# Altium project TermoDeep.PrjPcb
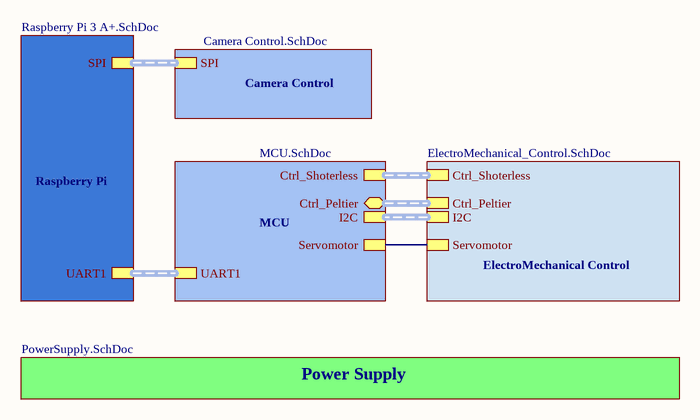
[diagram p0: TermoDeep.SchDoc]
6 sheets, 79 parts. Net scope: hierarchical (ports join the sheet entries above them; power ports are global).
Board file: TermoDeep.PcbDoc
Sheets:
  TermoDeep.SchDoc
    Power Supply = PowerSupply.SchDoc
    MCU = MCU.SchDoc
    ElectroMechanical Control = ElectroMechanical_Control.SchDoc
    Raspberry Pi = Raspberry Pi 3 A+.SchDoc
    Camera Control = Camera Control.SchDoc

## Sheet TermoDeep.SchDoc: Termodeep
size A4; Revision: V1.10 Rev A; Proyect DSD: Termodeep; Version: V 1.0  Rev A

### Sub-sheets
Camera Control = Camera Control.SchDoc: SPI (harness SPI)
ElectroMechanical Control = ElectroMechanical_Control.SchDoc: Ctrl_Peltier (harness Ctrl_Peltier), Ctrl_Shoterless (harness Ctrl_Shoterless), Servomotor, I2C (harness I2C)
MCU = MCU.SchDoc: Ctrl_Peltier (bidir, harness Ctrl_Peltier), Ctrl_Shoterless (harness Ctrl_Shoterless), Servomotor, UART1 (harness UART1), I2C
Power Supply = PowerSupply.SchDoc: no entries
Raspberry Pi = Raspberry Pi 3 A+.SchDoc: UART1 (harness UART1), SPI (harness SPI)

### Nets
D2: sheet MCU/Servomotor, sheet ElectroMechanical Control/Servomotor

### Buses and harness runs
harness sheet Camera Control/SPI = sheet Raspberry Pi/SPI
harness sheet ElectroMechanical Control/Ctrl_Peltier = sheet MCU/Ctrl_Peltier
harness sheet ElectroMechanical Control/Ctrl_Shoterless = sheet MCU/Ctrl_Shoterless
harness sheet ElectroMechanical Control/I2C = sheet MCU/I2C
harness sheet MCU/UART1 = sheet Raspberry Pi/UART1

### Notes on the sheet
- Title
- Size:
- Date:
- A4
- Version
- Sheet
- of
- DeepSea Developments
- Cll  2A # 24C - 25
- Cali, Valle del Cauca
- Colombia
- www.dsd.dev
- Proyect:

## Sheet PowerSupply.SchDoc: TermoDeep - Power Supply
size A4; Revision: V1.0 Rev A; Proyect DSD: TermoDeep; Version: V 1.0  Rev A
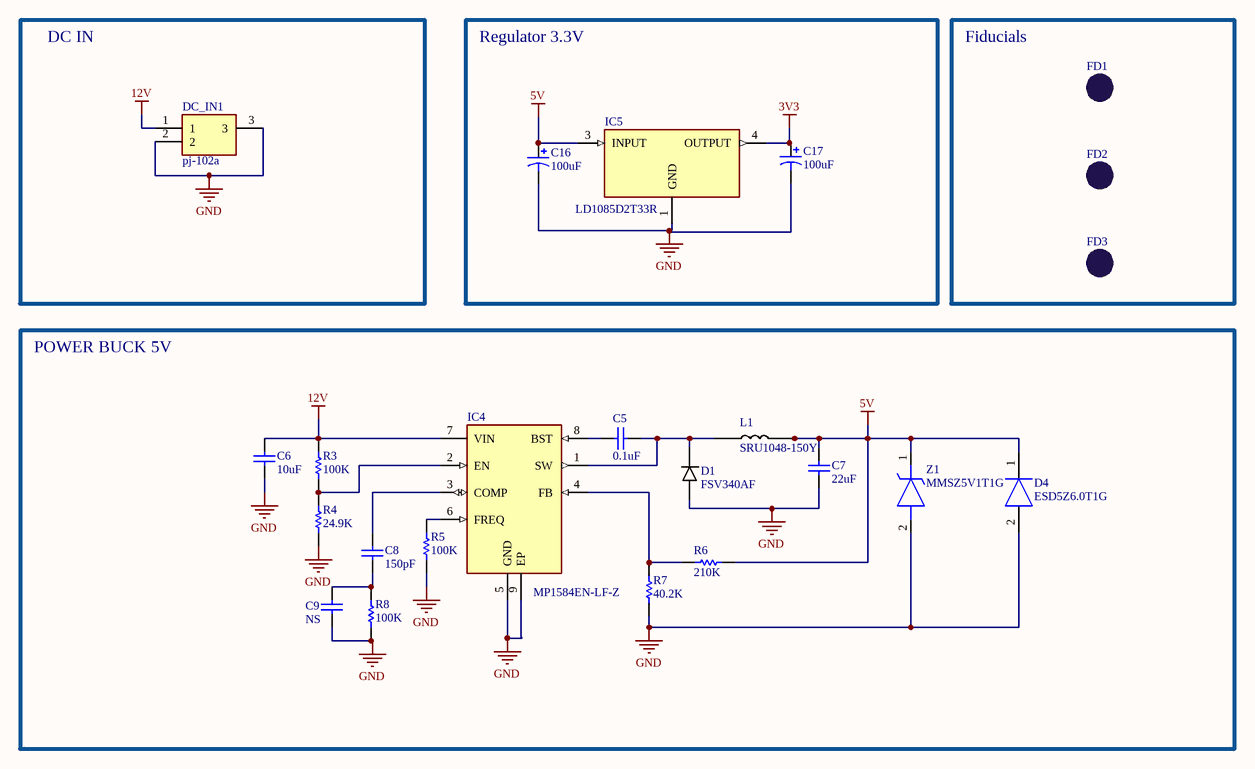
[diagram p1: PowerSupply.SchDoc]

### Parts
C5  0.1uF  [C0603_N]
C6  10uF  [C0805_N]
C7  22uF  [C0805_N]
C8  150pF  [C0603_N]
C9  NS  [C0603_N]
C16  100uF  [C_TANT_A_3216_N]
C17  100uF  [C_TANT_A_3216_N]
D1  FSV340AF  [SODFL4725X100N]
D4  ESD5Z6.0T1G  [SODFL1608X70N]
DC_IN1  pj-102a  [PJ059A]
FD1  Fiducial  [Fiducial]  (value not drawn)
FD2  Fiducial  [Fiducial]  (value not drawn)
FD3  Fiducial  [Fiducial]  (value not drawn)
IC4  MP1584EN-LF-Z  [SOIC127P600X170-9N]
IC5  LD1085D2T33R  [LD1085D2T33R]
L1  SRU1048-150Y  [SRU10486R8Y]
R3  100K  [R0603_N]
R4  24.9K  [R0603_N]
R5  100K  [R0603_N]
R6  210K  [R0603_N]
R7  40.2K  [R0603_N]
R8  100K  [R0603_N]
Z1  MMSZ5V1T1G  [SOD3716X135N]

### Blocks framed on the sheet
DC IN: DC_IN1
Regulator 3.3V: C16 C17 IC5
Fiducials: FD1-FD3
POWER BUCK 5V: C5-C9 D1 D4 IC4 L1 R3-R8 Z1

### Nets
3V3: C17.1 IC5.4(OUTPUT)
5V: C7.1 C16.1 D4.1(K) IC5.3(INPUT) L1.2 R6.1 Z1.1(K)
12V: C6.2 DC_IN1.1 IC4.7(VIN) R3.1
GND: C6.1 C7.2 C9.1 C16.2 C17.2 D1.2(A) D4.2(A) DC_IN1.2 DC_IN1.3 IC4.5(GND) IC4.9(EP) IC5.1(GND) R4.2 R5.2 R7.1 R8.2 Z1.2(A)
NetC5_1: C5.1 D1.1(K) IC4.1(SW) L1.1
NetC5_2: C5.2 IC4.8(BST)
NetC8_1: C8.1 C9.2 R8.1
NetC8_2: C8.2 IC4.3(COMP)
NetIC4_2: IC4.2(EN) R3.2 R4.1
NetIC4_4: IC4.4(FB) R6.2 R7.2
NetIC4_6: IC4.6(FREQ) R5.1

### Notes on the sheet
- Title
- Size:
- Date:
- A4
- Version
- Sheet
- of
- DeepSea Developments
- Cll  2A # 24C - 25
- Cali, Valle del Cauca
- Colombia
- www.dsd.dev
- Proyect:

### Library data of the parts
C5-C9 = C_SMD
  C5: Value: 0.1uF
  C6: Value: 10uF
  C7: Value: 22uF
  C8: Value: 150pF
  C9: Value: NS
C16 C17 = CP_SMD: Value: 100uF
D1 = FSV340AF: Diode; Manufacturer_Name: ON Semiconductor; Datasheet Link: https://componentsearchengine.com/Datasheets/1/FSV340AF.pdf; Height: 1mm; Manufacturer_Part_Number: FSV340AF; Mouser Part Number: 512-FSV340AF; Mouser Price/Stock: https://www.mouser.com/Search/Refine.aspx?Keyword=512-FSV340AF
D4 = ESD5Z6.0T1G: Diode; Manufacturer_Name: ON Semiconductor; Datasheet Link: http://www.onsemi.com/pub/Collateral/ESD5Z2.5T1-D.PDF; Height: 0.7mm; Manufacturer_Part_Number: ESD5Z6.0T1G; Arrow Part Number: ESD5Z6.0T1G; Arrow Price/Stock: https://www.arrow.com/en/products/esd5z6.0t1g/on-semiconductor; Mouser Part Number: 863-ESD5Z6.0T1G; Mouser Price/Stock: https://www.mouser.co.uk/ProductDetail/ON-Semiconductor/ESD5Z60T1G?qs=OSf9jACorvYUyIPFpvnErQ%3D%3D
DC_IN1 = PJ-059A: Connector; Manufacturer_Name: CUI Devices; Datasheet Link: https://www.cui.com/product/resource/digikeypdf/pj-059a.pdf; Height: 11.2mm; Manufacturer_Part_Number: PJ-059A; Mouser Part Number: 490-PJ-059A; Mouser Price/Stock: https://www.mouser.com/Search/Refine.aspx?Keyword=490-PJ-059A
IC4 = MP1584EN-LF-Z: Integrated Circuit; Manufacturer_Name: Monolithic Power Systems (MPS); Datasheet Link: https://componentsearchengine.com/Datasheets/1/MP1584EN-LF-Z.pdf; Height: 1.7mm; Manufacturer_Part_Number: MP1584EN-LF-Z; Mouser Part Number: 946-MP1584ENLFZ; Mouser Price/Stock: https://www.mouser.com/Search/Refine.aspx?Keyword=946-MP1584ENLFZ
IC5 = LD1085D2T33R: Integrated Circuit; Manufacturer_Name: STMicroelectronics; Allied_Number: 70407295; Datasheet Link: http://www.st.com/web/en/resource/technical/document/datasheet/CD00001883.pdf; Manufacturer_Part_Number: LD1085D2T33R; Mouser Part Number: 511-LD1085D2T33-TR; Mouser Price/Stock: https://www.mouser.com/Search/Refine.aspx?Keyword=511-LD1085D2T33-TR; RS Part Number: 6869209P; RS Price/Stock: http://uk.rs-online.com/web/p/products/6869209P; Allied Price/Stock: http://www.alliedelec.com/stmicroelectronics-ld1085d2t33r/70407295/
L1 = SRU1048-150Y: Inductor; Manufacturer_Name: Bourns; Datasheet Link: https://www.bourns.com/docs/Product-Datasheets/SRU1048.pdf; Height: 5mm; Manufacturer_Part_Number: SRU1048-150Y; Mouser Part Number: 652-SRU1048-150Y; Mouser Price/Stock: https://www.mouser.com/Search/Refine.aspx?Keyword=652-SRU1048-150Y; RS Part Number: 7633590P; RS Price/Stock: http://uk.rs-online.com/web/p/products/7633590P
R3-R8 = R_SMD: 1%
  R3 R5 R8: Value: 100K
  R4: Value: 24.9K
  R6: Value: 210K
  R7: Value: 40.2K
Z1 = MMSZ5V1T1G: Zener Diode; Manufacturer_Name: ON Semiconductor; Datasheet Link: http://docs-emea.rs-online.com/webdocs/078e/0900766b8078eb5b.pdf; Height: 1.35mm; Manufacturer_Part_Number: MMSZ5V1T1G; Arrow Part Number: MMSZ5V1T1G; Arrow Price/Stock: https://www.arrow.com/en/products/mmsz5v1t1g/on-semiconductor; Mouser Part Number: 863-MMSZ5V1T1G; Mouser Price/Stock: https://www.mouser.co.uk/ProductDetail/ON-Semiconductor/MMSZ5V1T1G?qs=ZpPixqFcBtyTVyk6YoEMxQ%3D%3D

## Sheet MCU.SchDoc: Termodeep- MCU
size A4; Proyect DSD: TermoDeep; Version: V 1.0  Rev A
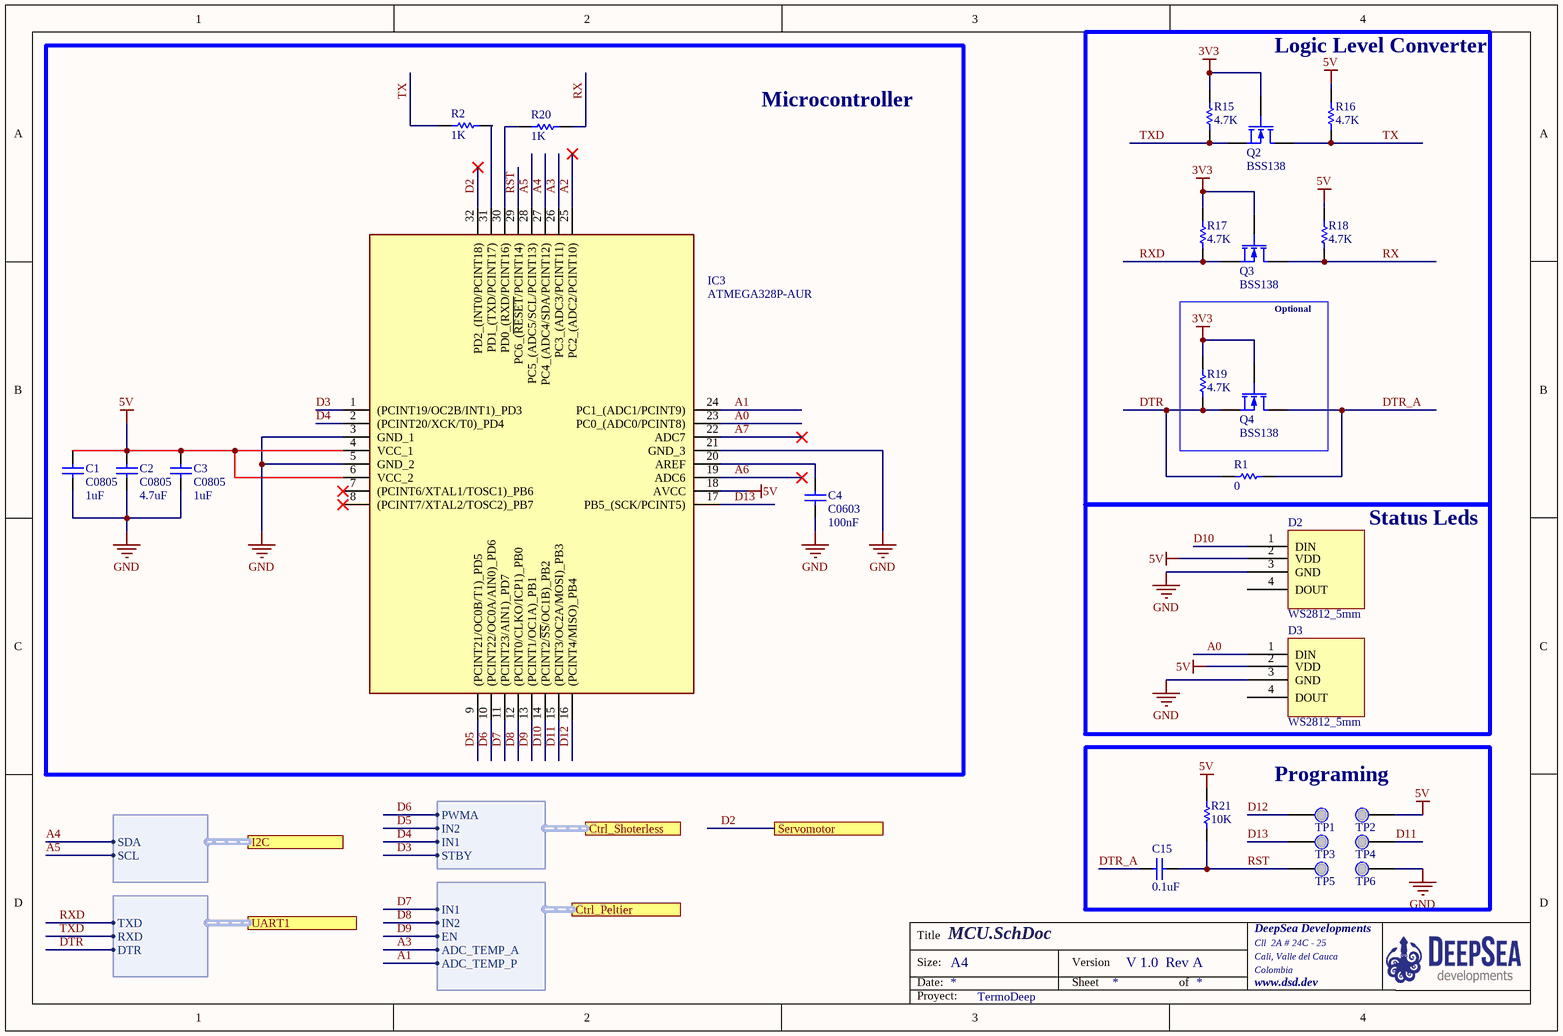
[diagram p2: MCU.SchDoc]

### Parts
C1  C0805  value 1uF  [0805]
C2  C0805  value 4.7uF  [0805]
C3  C0805  value 1uF  [0805]
C4  C0603  value 100nF  [CP0603_N]
C15  0.1uF  [C0603_L]
D2  WS2812_5mm  [Ws2812_5mm]
D3  WS2812_5mm  [Ws2812_5mm]
IC3  ATMEGA328P-AUR  [QFP80P900X900X120-32N]
Q2  BSS138  [SOT23]
Q3  BSS138  [SOT23]
Q4  BSS138  [SOT23]
R1  0  [R0603_N]
R2  1K  [R0603_N]
R15  4.7K  [R0603_N]
R16  4.7K  [R0603_N]
R17  4.7K  [R0603_N]
R18  4.7K  [R0603_N]
R19  4.7K  [R0603_N]
R20  1K  [R0603_N]
R21  10K  [R0603_N]
TP1  Test_Point  [TestPoint]  (value not drawn)
TP2  Test_Point  [TestPoint]  (value not drawn)
TP3  Test_Point  [TestPoint]  (value not drawn)
TP4  Test_Point  [TestPoint]  (value not drawn)
TP5  Test_Point  [TestPoint]  (value not drawn)
TP6  Test_Point  [TestPoint]  (value not drawn)

### Blocks framed on the sheet
Microcontroller: C1-C4 IC3 R2 R20
Logic Level Converter: Q2 Q3 R1 R15-R18
Optional: Q4 R19
Status Leds: D2 D3
Programing: C15 R21 TP1-TP6

### Ports
Ctrl_Peltier (harness Ctrl_Peltier), Ctrl_Shoterless (harness Ctrl_Shoterless), I2C (harness I2C), Servomotor, UART1 (harness UART1)

### Harnesses
I2C: SDA, SCL
Ctrl_Peltier: IN1, IN2, EN, ADC_TEMP_A, ADC_TEMP_P
Ctrl_Shoterless: PWMA, IN2, IN1, STBY
UART1: TXD, RXD, DTR

### Nets
3V3: Q2.3(G) Q3.3(G) Q4.3(G) R15.1 R17.1 R19.1
5V: C1.2 C2.2 C3.2 D2.2(VDD) D3.2(VDD) IC3.4(VCC_1) IC3.6(VCC_2) IC3.18(AVCC) R16.1 R18.1 R21.1 TP2.0(TP)
GND: C1.1 C2.1 C3.1 C4.1 D2.3(GND) D3.3(GND) IC3.3(GND_1) IC3.5(GND_2) IC3.21(GND_3) TP6.0(TP)
A0: D3.1(DIN) IC3.23(PC0_(ADC0/PCINT8))
A1: IC3.24(PC1_(ADC1/PCINT9)) ; port Ctrl_Peltier.ADC_TEMP_P
A2: IC3.25(PC2_(ADC2/PCINT10))
A3: IC3.26(PC3_(ADC3/PCINT11)) ; port Ctrl_Peltier.ADC_TEMP_A
A4: IC3.27(PC4_(ADC4/SDA/PCINT12)) ; port I2C.SDA
A5: IC3.28(PC5_(ADC5/SCL/PCINT13)) ; port I2C.SCL
A6: IC3.19(ADC6)
A7: IC3.22(ADC7)
D2: IC3.32(PD2_(INT0/PCINT18)) ; port Servomotor
D3: IC3.1((PCINT19/OC2B/INT1)_PD3) ; port Ctrl_Shoterless.STBY
D4: IC3.2((PCINT20/XCK/T0)_PD4) ; port Ctrl_Shoterless.IN1
D5: IC3.9((PCINT21/OC0B/T1)_PD5) ; port Ctrl_Shoterless.IN2
D6: IC3.10((PCINT22/OC0A/AIN0)_PD6) ; port Ctrl_Shoterless.PWMA
D7: IC3.11((PCINT23/AIN1)_PD7) ; port Ctrl_Peltier.IN1
D8: IC3.12((PCINT0/CLKO/ICP1)_PB0) ; port Ctrl_Peltier.IN2
D9: IC3.13((PCINT1/OC1A)_PB1) ; port Ctrl_Peltier.EN
D10: D2.1(DIN) IC3.14((PCINT2/~{SS}/OC1B)_PB2)
D11: IC3.15((PCINT3/OC2A/MOSI)_PB3) TP4.0(TP)
D12: IC3.16((PCINT4/MISO)_PB4) TP1.0(TP)
D13: IC3.17(PB5_(SCK/PCINT5)) TP3.0(TP)
DTR: Q4.2(S) R1.1 R19.2 ; port UART1.DTR
DTR_A: C15.1 Q4.1(D) R1.2
RST: C15.2 IC3.29(PC6_(~{RESET}/PCINT14)) R21.2 TP5.0(TP)
RX: Q3.1(D) R18.2 R20.2
RXD: Q3.2(S) R17.2 ; port UART1.TXD  [project net GPIO 14]
TX: Q2.1(D) R2.1 R16.2
TXD: Q2.2(S) R15.2 ; port UART1.RXD  [project net GPIO 15]
NetC4_2: C4.2 IC3.20(AREF)
NetIC3_30: IC3.30(PD0_(RXD/PCINT16)) R20.1
NetIC3_31: IC3.31(PD1_(TXD/PCINT17)) R2.2

Not connected (* = marked no-connect by the designer): D2 4(DOUT); D3 4(DOUT); IC3 7((PCINT6/XTAL1/TOSC1)_PB6)* 8((PCINT7/XTAL2/TOSC2)_PB7)*

### Notes on the sheet
- Title
- Size:
- Date:
- A4
- Version
- Sheet
- of
- DeepSea Developments
- Cll  2A # 24C - 25
- Cali, Valle del Cauca
- Colombia
- www.dsd.dev
- Proyect:

### Library data of the parts
C1-C4 = C0805: Ceramic Chip Capacitor - Standard; Note: Footprint corresponds to dimensions for bulk cassette packaging. This case size has tightened tolerances.; Published: 17-Jul-2002; LatestRevisionDate: 19-Mar-2004; LatestRevisionNote: Silkscreen size reduced.; DatasheetDocument: Mar-2001; PackageDocument: Mar-2001; PackageReference: 0805; Publisher: Altium Limited; Code_JEITA: 0805; Code_IPC: 2012[0805]; ComponentLink1Description: Manufacturer Link; ComponentLink1URL: http://www.kemet.com/; ComponentLink2Description: Datasheet; ComponentLink2URL: http://www.kemet.com/kemet/web/homepage/kechome.nsf/vapubfilesname/F3102TA.pdf/$file/F3102TA.pdf
C15 = C_SMD: Value: 0.1uF
IC3 = ATMEGA328-AUR: Integrated Circuit; Manufacturer_Name: Microchip; Datasheet Link: https://componentsearchengine.com/Datasheets/1/ATMEGA328-AUR.pdf; Height: 1.2mm; Manufacturer_Part_Number: ATMEGA328-AUR; Mouser Part Number: 556-ATMEGA328-AUR; Mouser Price/Stock: https://www.mouser.co.uk/ProductDetail/Microchip-Technology-Atmel/ATMEGA328-AUR?qs=lwdSMh1%2FoYLfe%252B5OKFEFrw%3D%3D; RS Part Number: 1773199P; RS Price/Stock: http://uk.rs-online.com/web/p/products/1773199P
Q2-Q4 = BSS138: N-Channel Enhancement Mode Vertical DMOS FET; Published: 17-Dec-2003; DatasheetVersion: Mar-96; PackageVersion: 1996; PackageReference: SOT23; Publisher: Altium Limited; PackageDescription: SOT-23; 3 Leads; Body 3.1 x 2.5 mm, inc. leads (LxW max), Alternate Lead Configuration; ComponentLink1Description: Manufacturer Link; ComponentLink1URL: http://www.zetex.com/; ComponentLink2Description: Datasheet; ComponentLink2URL: www.zetex.com/3.0/pdf/BSS138.pdf
R1 R2 R15-R21 = R_SMD
  R1: Value: 0
  R2 R20: Value: 1K
  R15-R19: Value: 4.7K
  R21: Value: 10K

## Sheet ElectroMechanical_Control.SchDoc
size A4; Version: V 1.0  Rev A
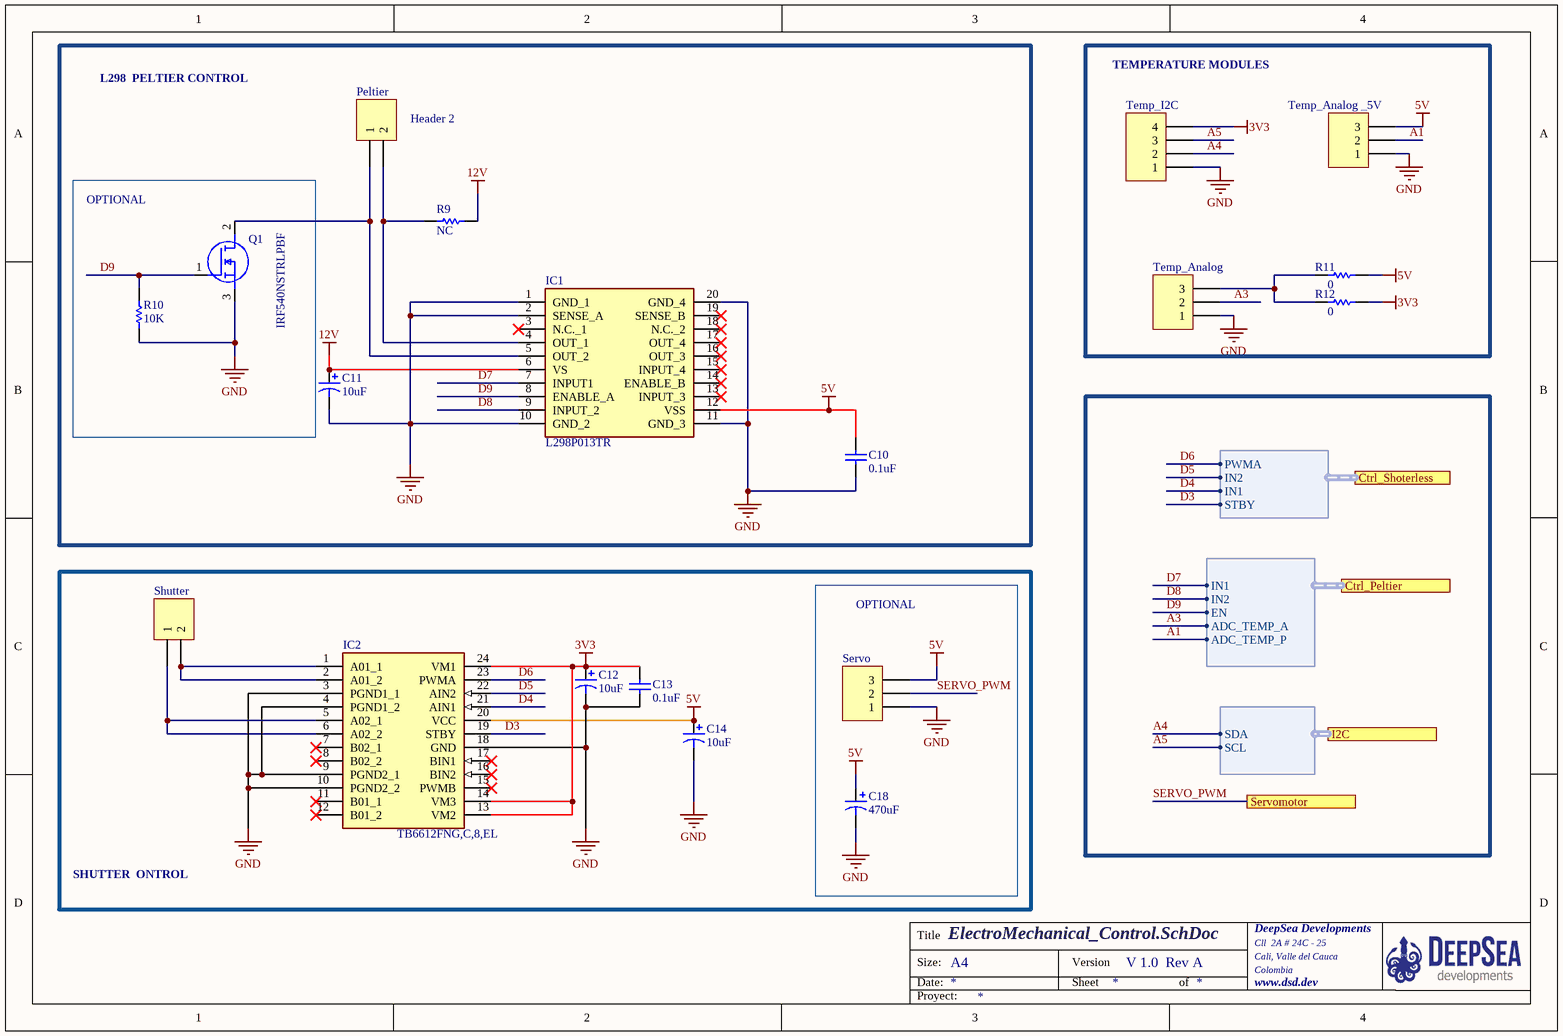
[diagram p3: ElectroMechanical_Control.SchDoc]

### Parts
C10  0.1uF  [C0603_L]
C11  10uF  [C_TANT_A_3216_L]
C12  10uF  [C_TANT_A_3216_L]
C13  0.1uF  [C0603_L]
C14  10uF  [C_TANT_A_3216_L]
C18  470uF  [C_ELECT_8X10_SMD_L]
IC1  L298P013TR  [SOIC127P1420X360-20N]
IC2  TB6612FNG,C,8,EL  [SOP65P760X160-24N]
Peltier  Header 2  [HDR1X2]
Q1  IRF540NSTRLPBF  [D2PAK]
R9  NC  [R0805_M]
R10  10K  [R0603_L]
R11  0  [R0603_L]
R12  0  [R0603_L]
Servo  Temp_Analog  [HDR1X3]  (value not drawn)
Shutter  Shotter  [HDR1X2]  (value not drawn)
Temp_Analog  Temp_Analog  [HDR1X3]  (value not drawn)
Temp_Analog__5V  Temp_Analog _5V  [HDR1X3]  (value not drawn)
Temp_I2C  Temp_I2C  [HDR1X4]  (value not drawn)

### Blocks framed on the sheet
L298  PELTIER CONTROL: C10 C11 IC1 Peltier R9
TEMPERATURE MODULES: R11 R12 Temp_Analog Temp_Analog__5V Temp_I2C
OPTIONAL: Q1 R10
SHUTTER  ONTROL: C12-C14 IC2 Shutter
OPTIONAL: C18 Servo

### Ports
Ctrl_Peltier (harness Ctrl_Peltier), Ctrl_Shoterless (harness Ctrl_Shoterless), I2C (harness I2C), Servomotor

### Harnesses
Ctrl_Peltier: IN1, IN2, EN, ADC_TEMP_A, ADC_TEMP_P
Ctrl_Shoterless: PWMA, IN2, IN1, STBY
I2C: SDA, SCL

### Nets
3V3: C12.1 C13.2 IC2.13(VM2) IC2.14(VM3) IC2.24(VM1) R12.2 Temp_I2C.4
5V: C10.2 C14.1 C18.1 IC1.12(VSS) IC2.20(VCC) R11.2 Servo.3 Temp_Analog__5V.3
12V: C11.1 IC1.6(VS) R9.2
GND: C10.1 C11.2 C12.2 C13.1 C14.2 C18.2 IC1.1(GND_1) IC1.2(SENSE_A) IC1.10(GND_2) IC1.11(GND_3) IC1.20(GND_4) IC2.3(PGND1_1) IC2.4(PGND1_2) IC2.9(PGND2_1) IC2.10(PGND2_2) IC2.18(GND) Q1.3(S) R10.1 Servo.1 Temp_Analog.1 Temp_Analog__5V.1 Temp_I2C.1
A1: Temp_Analog__5V.2 ; port Ctrl_Peltier.ADC_TEMP_P
A3: Temp_Analog.2 ; port Ctrl_Peltier.ADC_TEMP_A
A4: Temp_I2C.2 ; port I2C.SDA
A5: Temp_I2C.3 ; port I2C.SCL
D3: IC2.19(STBY) ; port Ctrl_Shoterless.STBY
D4: IC2.21(AIN1) ; port Ctrl_Shoterless.IN1
D5: IC2.22(AIN2) ; port Ctrl_Shoterless.IN2
D6: IC2.23(PWMA) ; port Ctrl_Shoterless.PWMA
D7: IC1.7(INPUT1) ; port Ctrl_Peltier.IN1
D8: IC1.9(INPUT_2) ; port Ctrl_Peltier.IN2
D9: IC1.8(ENABLE_A) Q1.1(G) R10.2 ; port Ctrl_Peltier.EN
SERVO_PWM: Servo.2 ; port Servomotor  [project net D2]
NetIC1_4: IC1.4(OUT_1) Peltier.2 R9.1
NetIC1_5: IC1.5(OUT_2) Peltier.1 Q1.2(D)
NetIC2_1: IC2.1(A01_1) IC2.2(A01_2) Shutter.2
NetIC2_5: IC2.5(A02_1) IC2.6(A02_2) Shutter.1
NetR11_1: R11.1 R12.1 Temp_Analog.3

Not connected (* = marked no-connect by the designer): IC1 3(N.C._1)* 13(INPUT_3)* 14(ENABLE_B)* 15(INPUT_4)* 16(OUT_3)* 17(OUT_4)* 18(N.C._2)* 19(SENSE_B)*; IC2 7(B02_1)* 8(B02_2)* 11(B01_1)* 12(B01_2)* 15(PWMB)* 16(BIN2)* 17(BIN1)*

### Notes on the sheet
- Title
- Size:
- Date:
- A4
- Version
- Sheet
- of
- DeepSea Developments
- Cll  2A # 24C - 25
- Cali, Valle del Cauca
- Colombia
- www.dsd.dev
- Proyect:

### Library data of the parts
C10 C13 = C_SMD: Value: 0.1uF
C11 C12 C14 = CP_SMD: Value: 10uF
C18 = C_SMD_UWT1A471MNL1GS: CAP ALUM 470UF 20% 10V SMD; Manufacturer: Nichicon; Lifetime @ Temp.: 1000 Hrs @ 105°C; Polarization: Polar; Surface Mount Land Size: 0.327" L x 0.327" W (8.30mm x 8.30mm); Supplier 1: Digi-Key; Manufacturer Part Number: UWT1A471MNL1GS; RoHS: RoHS Compliant; Category: Capacitors; Stock 1: 647; Pricing 1: 1=0.51, 10=0.358, 100=0.236 (USD); Packaging: Cut Tape (CT); Part Status: Active; Tolerance: ±20%; ESR (Equivalent Series Resistance): -; Operating Temperature: -55°C ~ 105°C; Ratings: -; Applications: General Purpose; Lead Spacing: -; Size / Dimension: 0.315" Dia (8.00mm); Height - Seated (Max): 0.394" (10.00mm); Mounting Type: Surface Mount; Package / Case: Radial, Can - SMD; ComponentLink1URL: http://nichicon-us.com/english/products/pdfs/e-uwt.pdf; ComponentLink1Description: http://nichicon-us.com/english/products/pdfs/e-uwt.pdf; Supplier Part Number 1: 493-2169-1-ND
IC1 = L298P013TR: Integrated Circuit; Manufacturer_Name: STMicroelectronics; Datasheet Link: http://www.st.com/content/ccc/resource/technical/document/datasheet/82/cc/3f/39/0a/29/4d/f0/CD00000240.pdf/files/CD00000240.pdf/jcr:content/translations/en.CD00000240.pdf; Height: 3.6mm; Manufacturer_Part_Number: L298P013TR; Mouser Part Number: 511-L298P-TR; Mouser Price/Stock: https://www.mouser.co.uk/ProductDetail/STMicroelectronics/L298P013TR?qs=39wMW%2Fm1xHLrH6PUe%2FOPcw%3D%3D; RS Part Number: 8805308P; RS Price/Stock: http://uk.rs-online.com/web/p/products/8805308P
IC2 = TB6612FNG,C,8,EL: Integrated Circuit; Manufacturer_Name: Toshiba; Datasheet Link: http://toshiba.semicon-storage.com/info/docget.jsp?did=10660&prodName=TB6612FNG; Height: 1.6mm; Manufacturer_Part_Number: TB6612FNG,C,8,EL; Mouser Part Number: 757-TB6612FNGC8EL; Mouser Price/Stock: https://www.mouser.co.uk/ProductDetail/Toshiba/TB6612FNGC8EL?qs=rsevcuukUAy2UalRuv4E%2FQ%3D%3D
Peltier Shutter = Header 2: Header, 2-Pin; LatestRevisionDate: 17-Jul-2002; LatestRevisionNote: Re-released for DXP Platform.; Publisher: Altium Limited
Q1 = IRF540NSTRLPBF: MOSFET (N-Channel); Manufacturer_Name: Infineon; Datasheet Link: https://www.infineon.com/dgdl/irf540nspbf.pdf?fileId=5546d462533600a4015355e3a72819a3; Manufacturer_Part_Number: IRF540NSTRLPBF; Arrow Part Number: IRF540NSTRLPBF; Arrow Price/Stock: https://www.arrow.com/en/products/irf540nstrlpbf/infineon-technologies-ag; Mouser Part Number: 942-IRF540NSTRLPBF; Mouser Price/Stock: https://www.mouser.co.uk/ProductDetail/Infineon-Technologies/IRF540NSTRLPBF?qs=9%252BKlkBgLFf3O%252Bc3IfthtMA%3D%3D
R9-R12 = R_SMD
  R9: Value: NC
  R10: Value: 10K
  R11 R12: Value: 0
Servo Temp_Analog Temp_Analog__5V = Header 3: Header, 3-Pin; LatestRevisionDate: 17-Jul-2002; LatestRevisionNote: Re-released for DXP Platform.; Publisher: Altium Limited
Temp_I2C = Header 4: Header, 4-Pin; LatestRevisionDate: 17-Jul-2002; LatestRevisionNote: Re-released for DXP Platform.; Publisher: Altium Limited

## Sheet Raspberry Pi 3 A+.SchDoc
size A4; Version: V 1.0  Rev A
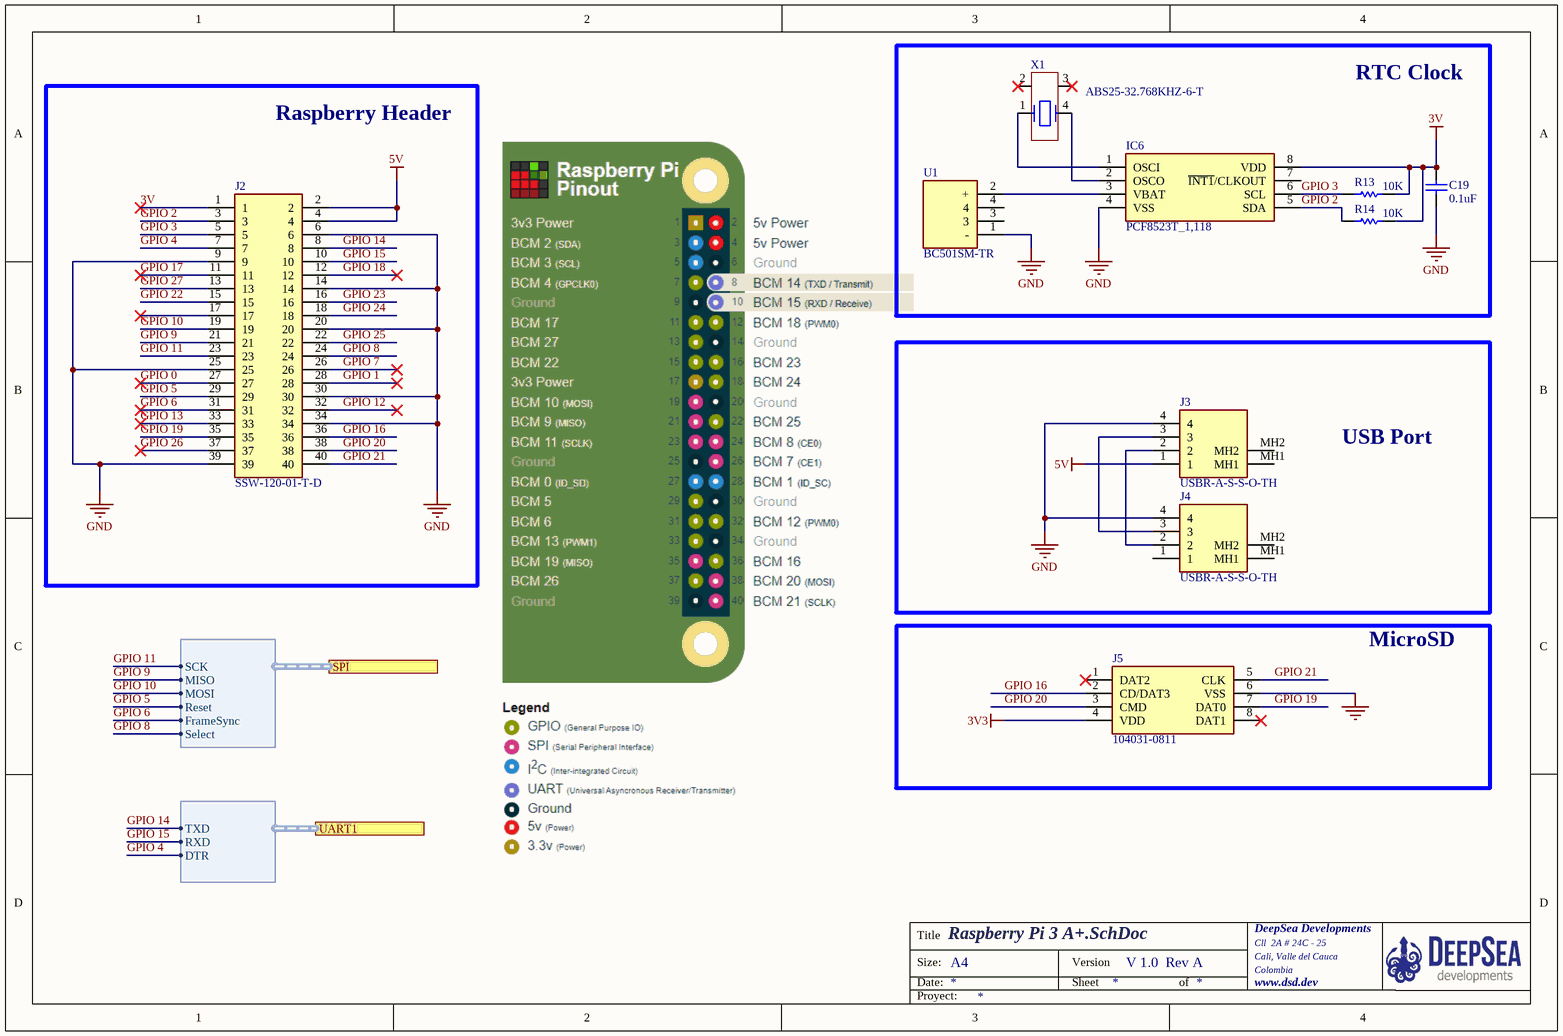
[diagram p4: Raspberry Pi 3 A+.SchDoc]

### Parts
C19  0.1uF  [C0603_L]
IC6  PCF8523T_1,118  [SOIC127P600X175-8N]
J2  SSW-120-01-T-D  [RHDR40W79P254_2X20_5131X495X851P]
J3  USBR-A-S-S-O-TH  [USB_A]
J4  USBR-A-S-S-O-TH  [USB_A]
J5  104031-0811  [1040310811]
R13  10K  [R0603_L]
R14  10K  [R0603_L]
U1  BC501SM-TR  [BC501SMTR]
X1  ABS25-32.768KHZ-6-T  [ABS25]

### Blocks framed on the sheet
Raspberry Header: J2
RTC Clock: C19 IC6 R13 R14 U1 X1
USB Port: J3 J4
MicroSD: J5

### Ports
SPI (harness SPI), UART1 (harness UART1)

### Harnesses
SPI: SCK, MISO, MOSI, Reset, FrameSync, Select
UART1: TXD, RXD, DTR

### Nets
3V: C19.2 IC6.8(VDD) J2.1 R13.2 R14.2
3V3: J5.4(VDD)
5V: J2.2 J2.4 J3.1
GND: C19.1 IC6.4(VSS) J2.6 J2.9 J2.14 J2.20 J2.25 J2.30 J2.34 J2.39 J3.4 J4.4 J5.6(VSS) U1.1(-)
GPIO 0: J2.27
GPIO 1: J2.28
GPIO 2: IC6.5(SDA) J2.3 R14.1
GPIO 3: IC6.6(SCL) J2.5 R13.1
GPIO 4: J2.7 ; port UART1.DTR  [project net DTR]
GPIO 5: J2.29 ; port SPI.Reset
GPIO 6: J2.31 ; port SPI.FrameSync
GPIO 7: J2.26
GPIO 8: J2.24 ; port SPI.Select
GPIO 9: J2.21 ; port SPI.MISO
GPIO 10: J2.19 ; port SPI.MOSI
GPIO 11: J2.23 ; port SPI.SCK
GPIO 12: J2.32
GPIO 13: J2.33
GPIO 14: J2.8 ; port UART1.TXD
GPIO 15: J2.10 ; port UART1.RXD
GPIO 16: J2.36 J5.2(CD/DAT3)
GPIO 17: J2.11
GPIO 18: J2.12
GPIO 19: J2.35 J5.7(DAT0)
GPIO 20: J2.38 J5.3(CMD)
GPIO 21: J2.40 J5.5(CLK)
GPIO 22: J2.15
GPIO 23: J2.16
GPIO 24: J2.18
GPIO 25: J2.22
GPIO 26: J2.37
GPIO 27: J2.13
NetIC6_1: IC6.1(OSCI) X1.1
NetIC6_2: IC6.2(OSCO) X1.4
NetIC6_3: IC6.3(VBAT) U1.2(+)
NetJ3_2: J3.2 J4.2
NetJ3_3: J3.3 J4.3

Not connected (* = marked no-connect by the designer): IC6 7(~{INT1}/CLKOUT); J2 17*; J3 MH1 MH2; J4 1 MH1 MH2; J5 1(DAT2)* 8(DAT1)*; U1 3 4; X1 2* 3*

### Notes on the sheet
- Title
- Size:
- Date:
- A4
- Version
- Sheet
- of
- DeepSea Developments
- Cll  2A # 24C - 25
- Cali, Valle del Cauca
- Colombia
- www.dsd.dev
- Proyect:

### Library data of the parts
C19 = C_SMD: Value: 0.1uF
IC6 = PCF8523T_1,118: Integrated Circuit; Manufacturer_Name: NXP; Manufacturer_Part_Number: PCF8523T/1,118; Datasheet Link: https://mouser.componentsearchengine.com/Datasheets/2/PCF8523T_1,118.pdf; Height: 1.75mm; Arrow Part Number: PCF8523T/1,118; Arrow Price/Stock: https://www.arrow.com/en/products/pcf8523t1118/nxp-semiconductors; Mouser Part Number: 771-PCF8523T/1118; Mouser Price/Stock: https://www.mouser.co.uk/ProductDetail/NXP-Semiconductors/PCF8523T-1118?qs=beN0Cyoe8YmmXShRMIPCwg%3D%3D
J2 = SSW-120-01-T-D: Connector; Manufacturer_Name: SAMTEC; Datasheet Link: https://mouser.componentsearchengine.com/Datasheets/2/SSW-120-01-T-D.pdf; Height: 8.51mm; Manufacturer_Part_Number: SSW-120-01-T-D; Mouser Part Number: 200-SSW12001TD; Mouser Price/Stock: https://www.mouser.co.uk/ProductDetail/Samtec/SSW-120-01-T-D?qs=rkdpAy2aP%2F%252BUeUPwq%252BhQGQ%3D%3D; RS Part Number: 1800457; RS Price/Stock: http://uk.rs-online.com/web/p/products/1800457
J3 J4 = USBR-A-S-S-O-TH: Connector; Manufacturer_Name: SAMTEC; Datasheet Link: http://suddendocs.samtec.com/prints/usbr-a-s-x-x-th-x-mkt.pdf; Height: 7.08mm; Manufacturer_Part_Number: USBR-A-S-S-O-TH; Mouser Part Number: 200-USBRASSOTH; Mouser Price/Stock: https://www.mouser.co.uk/ProductDetail/Samtec/USBR-A-S-S-O-TH?qs=rHlcMk0NooKn9e8hD2pFtg%3D%3D; RS Part Number: 1800517; RS Price/Stock: http://uk.rs-online.com/web/p/products/1800517
J5 = 104031-0811: Connector; Manufacturer_Name: Molex; Allied_Number: 70747077; Datasheet Link: http://www.molex.com/webdocs/datasheets/pdf/en-us/1040310811_MEMORY_CARD_SOCKET.pdf; Manufacturer_Part_Number: 104031-0811; Mouser Part Number: 538-104031-0811; Mouser Price/Stock: https://www.mouser.com/Search/Refine.aspx?Keyword=538-104031-0811; RS Part Number: 8967560; RS Price/Stock: http://uk.rs-online.com/web/p/products/8967560; Allied Price/Stock: http://www.alliedelec.com/molex-incorporated-104031-0811/70747077/
R13 R14 = R_SMD: Value: 10K
U1 = BC501SM-TR: Undefined or Miscellaneous; Manufacturer_Name: MPD (Memory Protection Devices); Datasheet Link: http://www.memoryprotectiondevices.com/datasheets/BC501SM-datasheet.pdf; Height: 4mm; Manufacturer_Part_Number: BC501SM-TR; Arrow Part Number: BC501SM-TR
X1 = MC306

## Sheet Camera Control.SchDoc
size A4; Version: V1.0  Rev A
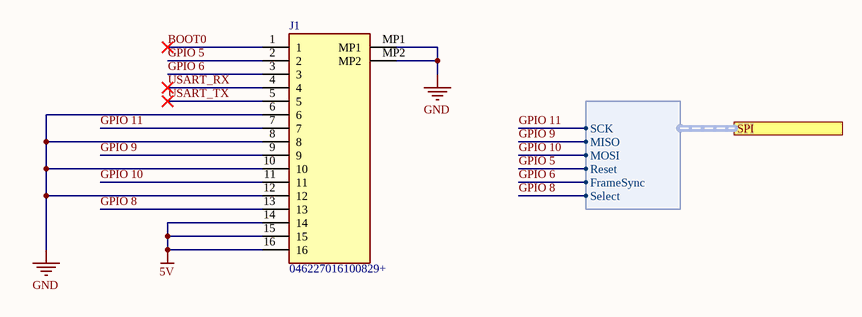
[diagram p5: Camera Control.SchDoc]

### Parts
J1  046227016100829+  [046227016100800]

### Ports
SPI (harness SPI)

### Harnesses
SPI: SCK, MISO, MOSI, Reset, FrameSync, Select

### Nets
5V: J1.14 J1.15 J1.16
GND: J1.6 J1.8 J1.10 J1.12 J1.MP1 J1.MP2
BOOT0: J1.1
GPIO 5: J1.2 ; port SPI.Reset
GPIO 6: J1.3 ; port SPI.FrameSync
GPIO 8: J1.13 ; port SPI.Select
GPIO 9: J1.9 ; port SPI.MISO
GPIO 10: J1.11 ; port SPI.MOSI
GPIO 11: J1.7 ; port SPI.SCK
USART_RX: J1.4
USART_TX: J1.5

### Notes on the sheet
- Title
- Size:
- Date:
- A4
- Version
- Sheet
- of
- DeepSea Developments
- Cll  2A # 24C - 25
- Cali, Valle del Cauca
- Colombia
- www.dsd.dev
- Proyect:

### Library data of the parts
J1 = 046227016100800+: Connector; Manufacturer_Name: Kyocera Electronic Components; Datasheet Link: https://componentsearchengine.com/Datasheets/1/046227016100800+.pdf; Height: 2mm; Manufacturer_Part_Number: 046227016100800+; Mouser Part Number: 581-046227016100800+; Mouser Price/Stock: https://www.mouser.com/Search/Refine.aspx?Keyword=581-046227016100800%2B

## Nets that join several sheets
3V3: PowerSupply (C17.1 IC5.4), MCU (6 pins), ElectroMechanical_Control (7 pins), Raspberry Pi 3 A+ (J5.4)
5V: PowerSupply (7 pins), MCU (12 pins), ElectroMechanical_Control (8 pins), Raspberry Pi 3 A+ (J2.2 J2.4 J3.1), Camera Control (J1.14 J1.15 J1.16)
12V: PowerSupply (C6.2 DC_IN1.1 IC4.7 R3.1), ElectroMechanical_Control (C11.1 IC1.6 R9.2)
GND: PowerSupply (17 pins), MCU (10 pins), ElectroMechanical_Control (22 pins), Raspberry Pi 3 A+ (14 pins), Camera Control (6 pins)
A1: MCU (IC3.24), ElectroMechanical_Control (Temp_Analog__5V.2)
A3: MCU (IC3.26), ElectroMechanical_Control (Temp_Analog.2)
A4: MCU (IC3.27), ElectroMechanical_Control (Temp_I2C.2)
A5: MCU (IC3.28), ElectroMechanical_Control (Temp_I2C.3)
D2: MCU (IC3.32), ElectroMechanical_Control (Servo.2)
D3: MCU (IC3.1), ElectroMechanical_Control (IC2.19)
D4: MCU (IC3.2), ElectroMechanical_Control (IC2.21)
D5: MCU (IC3.9), ElectroMechanical_Control (IC2.22)
D6: MCU (IC3.10), ElectroMechanical_Control (IC2.23)
D7: MCU (IC3.11), ElectroMechanical_Control (IC1.7)
D8: MCU (IC3.12), ElectroMechanical_Control (IC1.9)
D9: MCU (IC3.13), ElectroMechanical_Control (IC1.8 Q1.1 R10.2)
DTR: MCU (Q4.2 R1.1 R19.2), Raspberry Pi 3 A+ (J2.7)
GPIO 5: Raspberry Pi 3 A+ (J2.29), Camera Control (J1.2)
GPIO 6: Raspberry Pi 3 A+ (J2.31), Camera Control (J1.3)
GPIO 8: Raspberry Pi 3 A+ (J2.24), Camera Control (J1.13)
GPIO 9: Raspberry Pi 3 A+ (J2.21), Camera Control (J1.9)
GPIO 10: Raspberry Pi 3 A+ (J2.19), Camera Control (J1.11)
GPIO 11: Raspberry Pi 3 A+ (J2.23), Camera Control (J1.7)
GPIO 14: MCU (Q3.2 R17.2), Raspberry Pi 3 A+ (J2.8)
GPIO 15: MCU (Q2.2 R15.2), Raspberry Pi 3 A+ (J2.10)